# Altium schematic sheet TC377TP.SchDoc
size A3
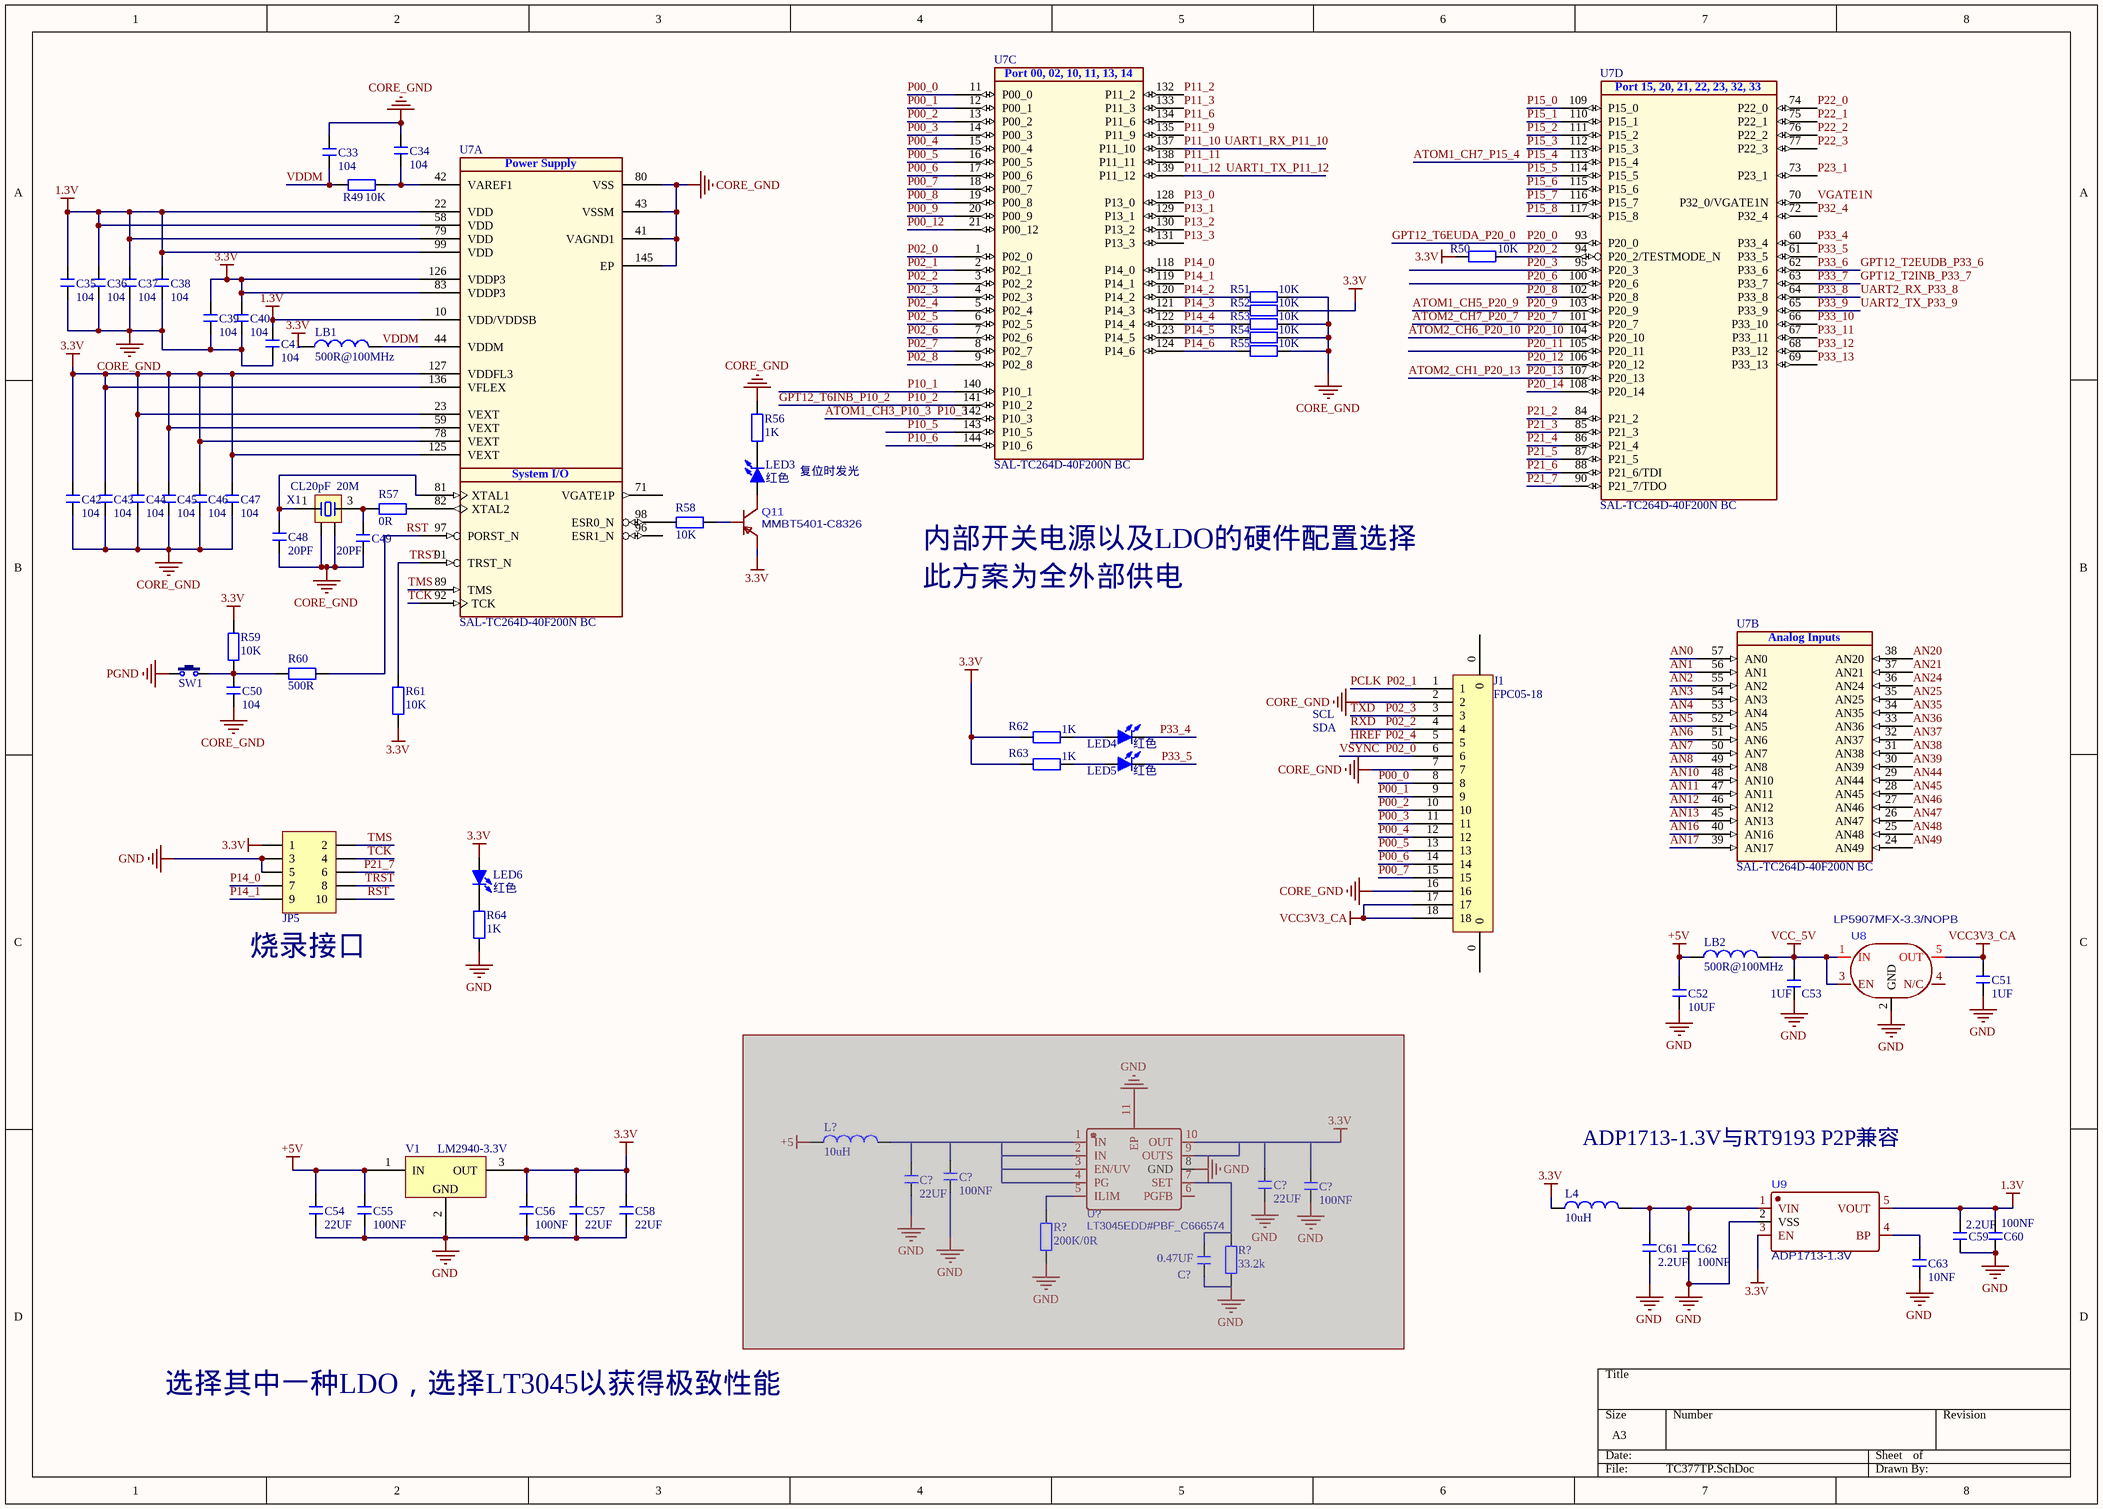
[diagram p0: TC377TP.SchDoc]

## Parts
(Parts that share a designator on the sheet are numbered #1, #2 ... from top to bottom, then left to right.)
C33  104  [C 0603_L]
C34  104  [C 0603_L]
C35  104  [C 0603_L]
C36  104  [C 0603_L]
C37  104  [C 0603_L]
C38  104  [C 0603_L]
C39  104  [C 0603_L]
C40  104  [C 0603_L]
C41  104  [C 0603_L]
C42  104  [C 0603_L]
C43  104  [C 0603_L]
C44  104  [C 0603_L]
C45  104  [C 0603_L]
C46  104  [C 0603_L]
C47  104  [C 0603_L]
C48  20PF  [C 0603_L]
C49  20PF  [C 0603_L]
C50  104  [C 0603_L]
C51  1UF  [C 0805_L]
C52  10UF  [C 0805_L]
C53  1UF  [C 0805_L]
C54  22UF  [C 0805_L]
C55  100NF  [C 0805_L]
C56  100NF  [C 0805_L]
C57  22UF  [C 0805_L]
C58  22UF  [C 0805_L]
C59  2.2UF  [C 0805_L]
C60  100NF  [C 0805_L]
C61  2.2UF  [C 0805_L]
C62  100NF  [C 0805_L]
C63  10NF  [C 0805_L]
C?#1  22UF  [C 0805_L]  (masked out: inside a compile mask, not in the netlist)
C?#2  100NF  [C 0805_L]  (masked out: inside a compile mask, not in the netlist)
C?#3  22UF  [C 0805_L]  (masked out: inside a compile mask, not in the netlist)
C?#4  100NF  [C 0805_L]  (masked out: inside a compile mask, not in the netlist)
C?#5  0.47UF  [C 0805_L]  (masked out: inside a compile mask, not in the netlist)
J1  FPC05-18  [FPC-05-18]
JP5  Header 5X2  [IDC2.54-LI-2x5P]  (value not drawn)
L4  10uH  [L 0805_L]
L?  10uH  [L 0805_L]  (masked out: inside a compile mask, not in the netlist)
LB1  500R@100MHz  [FB 0603_L]
LB2  500R@100MHz  [FB 0805_L]
LED3  红色  [LED 0603Y]
LED4  红色  [LED 0603Y]
LED5  红色  [LED 0603Y]
LED6  红色  [LED 0603Y]
Q11  MMBT5401-C8326  [SOT23-3L]
R49  10K  [R 0603_L]
R50  10K  [R 0603_L]
R51  10K  [R 0603_L]
R52  10K  [R 0603_L]
R53  10K  [R 0603_L]
R54  10K  [R 0603_L]
R55  10K  [R 0603_L]
R56  1K  [R 0603_L]
R57  0R  [R 0603_L]
R58  10K  [R 0603_L]
R59  10K  [R 0603_L]
R60  500R  [R 0603_L]
R61  10K  [R 0603_L]
R62  1K  [R 0603_L]
R63  1K  [R 0603_L]
R64  1K  [R 0603_L]
R?#1  200K/0R  [R 0805_L]  (masked out: inside a compile mask, not in the netlist)
R?#2  33.2k  [R 0805_L]  (masked out: inside a compile mask, not in the netlist)
SW1  3x6x5  [TSW SMD-3*6*2.5]  (value not drawn)
U7  SAL-TC264D-40F200N BC  [QFP50P2200X2200X160-145N-1]  (parts A,B,C,D of 4)
U8  LP5907MFX-3.3/NOPB  [SOT23-5L]
U9  ADP1713-1.3V  [SOT-23-5_L3.0-W1.7-P0.95-LS2.8-BL]
U?  LT3045EDD#PBF_C666574  [LT-3045]  (masked out: inside a compile mask, not in the netlist)
V1  LM2940-3.3V  [SOT223_L]
X1  20M  负载电容: CL20pF  [OSC 3225-4P]

## Nets
1.3V: C35.2 C36.2 C37.2 C38.2 C41.2 C59.1 C60.1 U7.10(VDD/VDDSB) U7.22(VDD) U7.58(VDD) U7.79(VDD) U7.99(VDD) U9.5(VOUT)
3.3V: C39.2 C40.2 C42.2 C43.2 C44.2 C45.2 C46.2 C47.2 C56.2 C57.2 C58.2 JP5.1 L4.1 LB1.1 LED6.1(A) Q11.2(E) R50.1 R52.2 R59.2 R61.1 R62.2 R63.2 U7.23(VEXT) U7.59(VEXT) U7.78(VEXT) U7.83(VDDP3) U7.125(VEXT) U7.126(VDDP3) U7.127(VDDFL3) U7.136(VFLEX) U9.3(EN) V1.3(OUT)
+5V: C52.1 C54.2 C55.2 LB2.1 V1.1(IN)
CORE_GND: C33.2 C34.2 C35.1 C36.1 C37.1 C38.1 C39.1 C40.1 C41.1 C42.1 C43.1 C44.1 C45.1 C46.1 C47.1 C48.1 C49.1 C50.1 J1.2 J1.7 J1.16 R51.2 R53.2 R54.2 R55.2 R56.1 U7.41(VAGND1) U7.43(VSSM) U7.80(VSS) U7.145(EP) X1.2 X1.4
GND: C51.2 C52.2 C53.2 C54.1 C55.1 C56.1 C57.1 C58.1 C59.2 C60.2 C61.2 C62.2 C63.2 JP5.3 JP5.5 R64.1 U8.2(GND) U9.2(VSS) V1.2(GND)
PGND: SW1.1
VCC3V3_CA: C51.1 J1.17 J1.18 U8.5(OUT)
VCC_5V: C53.1 LB2.2 U8.1(IN) U8.3(EN)
AN0: U7.57(AN0)
AN1: U7.56(AN1)
AN2: U7.55(AN2)
AN3: U7.54(AN3)
AN4: U7.53(AN4)
AN5: U7.52(AN5)
AN6: U7.51(AN6)
AN7: U7.50(AN7)
AN8: U7.49(AN8)
AN10: U7.48(AN10)
AN11: U7.47(AN11)
AN12: U7.46(AN12)
AN13: U7.45(AN13)
AN16: U7.40(AN16)
AN17: U7.39(AN17)
AN20: U7.38(AN20)
AN21: U7.37(AN21)
AN24: U7.36(AN24)
AN25: U7.35(AN25)
AN35: U7.34(AN35)
AN36: U7.33(AN36)
AN37: U7.32(AN37)
AN38: U7.31(AN38)
AN39: U7.30(AN39)
AN44: U7.29(AN44)
AN45: U7.28(AN45)
AN46: U7.27(AN46)
AN47: U7.26(AN47)
AN48: U7.25(AN48)
AN49: U7.24(AN49)
ATOM1_CH3_P10_3: U7.142(P10_3)  [also labelled P10_3]
ATOM1_CH5_P20_9: U7.103(P20_9)  [also labelled P20_9]
ATOM1_CH7_P15_4: U7.113(P15_4)  [also labelled P15_4]
ATOM2_CH1_P20_13: U7.107(P20_13)  [also labelled P20_13]
ATOM2_CH6_P20_10: U7.104(P20_10)  [also labelled P20_10]
ATOM2_CH7_P20_7: U7.101(P20_7)  [also labelled P20_7]
GPT12_T2EUDB_P33_6: U7.62(P33_6)  [also labelled P33_6]
GPT12_T2INB_P33_7: U7.63(P33_7)  [also labelled P33_7]
GPT12_T6EUDA_P20_0: U7.93(P20_0)  [also labelled P20_0]
GPT12_T6INB_P10_2: U7.141(P10_2)  [also labelled P10_2]
HREF: J1.5 U7.5(P02_4)  [also labelled P02_4]
P00_0: J1.8 U7.11(P00_0)
P00_1: J1.9 U7.12(P00_1)
P00_2: J1.10 U7.13(P00_2)
P00_3: J1.11 U7.14(P00_3)
P00_4: J1.12 U7.15(P00_4)
P00_5: J1.13 U7.16(P00_5)
P00_6: J1.14 U7.17(P00_6)
P00_7: J1.15 U7.18(P00_7)
P00_8: U7.19(P00_8)
P00_9: U7.20(P00_9)
P00_12: U7.21(P00_12)
P02_0: J1.6 U7.1(P02_0)  [also labelled VSYNC]
P02_1: J1.1 U7.2(P02_1)  [also labelled PCLK]
P02_2: J1.4 U7.3(P02_2)  [also labelled RXD]
P02_3: J1.3 U7.4(P02_3)  [also labelled TXD]
P02_5: U7.6(P02_5)
P02_6: U7.7(P02_6)
P02_7: U7.8(P02_7)
P02_8: U7.9(P02_8)
P10_1: U7.140(P10_1)
P10_5: U7.143(P10_5)
P10_6: U7.144(P10_6)
P11_2: U7.132(P11_2)
P11_3: U7.133(P11_3)
P11_6: U7.134(P11_6)
P11_9: U7.135(P11_9)
P11_10: U7.137(P11_10)  [also labelled UART1_RX_P11_10]
P11_11: U7.138(P11_11)
P11_12: U7.139(P11_12)  [also labelled UART1_TX_P11_12]
P13_0: U7.128(P13_0)
P13_1: U7.129(P13_1)
P13_2: U7.130(P13_2)
P13_3: U7.131(P13_3)
P14_0: JP5.7 U7.118(P14_0)
P14_1: JP5.9 U7.119(P14_1)
P14_2: R51.1 U7.120(P14_2)
P14_3: R52.1 U7.121(P14_3)
P14_4: R53.1 U7.122(P14_4)
P14_5: R54.1 U7.123(P14_5)
P14_6: R55.1 U7.124(P14_6)
P15_0: U7.109(P15_0)
P15_1: U7.110(P15_1)
P15_2: U7.111(P15_2)
P15_3: U7.112(P15_3)
P15_5: U7.114(P15_5)
P15_6: U7.115(P15_6)
P15_7: U7.116(P15_7)
P15_8: U7.117(P15_8)
P20_2: R50.2 U7.94(P20_2/TESTMODE_N)
P20_3: U7.95(P20_3)
P20_6: U7.100(P20_6)
P20_8: U7.102(P20_8)
P20_11: U7.105(P20_11)
P20_12: U7.106(P20_12)
P20_14: U7.108(P20_14)
P21_2: U7.84(P21_2)
P21_3: U7.85(P21_3)
P21_4: U7.86(P21_4)
P21_5: U7.87(P21_5)
P21_6: U7.88(P21_6/TDI)
P21_7: JP5.6 U7.90(P21_7/TDO)
P22_0: U7.74(P22_0)
P22_1: U7.75(P22_1)
P22_2: U7.76(P22_2)
P22_3: U7.77(P22_3)
P23_1: U7.73(P23_1)
P32_4: U7.72(P32_4)
P33_4: LED4.2(K) U7.60(P33_4)
P33_5: LED5.2(K) U7.61(P33_5)
P33_8: U7.64(P33_8)  [also labelled UART2_RX_P33_8]
P33_9: U7.65(P33_9)  [also labelled UART2_TX_P33_9]
P33_10: U7.66(P33_10)
P33_11: U7.67(P33_11)
P33_12: U7.68(P33_12)
P33_13: U7.69(P33_13)
RST: JP5.10 R60.2 U7.97(PORST_N)
TCK: JP5.4 U7.92(TCK)
TMS: JP5.2 U7.89(TMS)
TRST: JP5.8 R61.2 U7.91(TRST_N)
VDDM: C33.1 LB1.2 R49.2 U7.44(VDDM)
VGATE1N: U7.70(P32_0/VGATE1N)
NetC34_1: C34.1 R49.1 U7.42(VAREF1)
NetC48_2: C48.2 U7.81(XTAL1) X1.1
NetC49_2: C49.2 R57.1 X1.3
NetC50_2: C50.2 R59.1 R60.1 SW1.2
NetC61_1: C61.1 C62.1 L4.2 U9.1(VIN)
NetC63_1: C63.1 U9.4(BP)
NetLED3_1: LED3.1(A) Q11.3(C)
NetLED3_2: LED3.2(K) R56.2
NetLED4_1: LED4.1(A) R62.1
NetLED5_1: LED5.1(A) R63.1
NetLED6_2: LED6.2(K) R64.2
NetQ11_1: Q11.1(B) R58.1
NetR57_2: R57.2 U7.82(XTAL2)
NetR58_2: R58.2 U7.98(ESR0_N)

Not connected (* = marked no-connect by the designer): J1 0; U7 71(VGATE1P) 96(ESR1_N); U8 4(N/C)

## Notes on the sheet
- 复位时发光
- 内部开关电源以及LDO的硬件配置选择
- 此方案为全外部供电
- SCL
- SDA
- (near JP5) 烧录接口
- ADP1713-1.3V与RT9193 P2P兼容
- 选择其中一种LDO，选择LT3045以获得极致性能
- (in symbol SAL-TC264D-40F200N BC, part A) Power Supply; System I/O
- (in symbol SAL-TC264D-40F200N BC, part B) Analog Inputs
- (in symbol SAL-TC264D-40F200N BC, part C) Port 00, 02, 10, 11, 13, 14
- (in symbol SAL-TC264D-40F200N BC, part D) Port 15, 20, 21, 22, 23, 32, 33

## Library data of the parts
C33-C63 C?#1-C?#5 = C: 无极性贴片电容; 版权归属: 源创客; 材质: X7R; BOM名称: 无极性贴片电容; 学习资源: www.ooocke.com
JP5 = Header 5X2: 5*2P接插件; 版权归属: 源创客; BOM名称: 5*2P接插件; 学习资源: www.ooocke.com
L4 L? = L: 小功率贴片电感; 版权归属: 源创客; BOM名称: 小功率贴片电感; 学习资源: www.ooocke.com
LB1 LB2 = LB: 磁珠; 版权归属: 源创客; BOM名称: 磁珠; 学习资源: www.ooocke.com
LED3-LED6 = LED-SMD: 贴片LED; 版权归属: 源创客; BOM名称: 贴片LED; 学习资源: www.ooocke.com
R49-R64 R?#1 R?#2 = R: 贴片电阻; 版权归属: 源创客; BOM名称: 贴片电阻; 学习资源: www.ooocke.com
SW1 = TSW 3x6: 3x6轻触开关; 版权归属: 源创客; BOM名称: 3x6轻触开关; 学习资源: www.ooocke.com
U7 = SAL-TC264D-40F200N BC: 32-Bit Single-Chip Microcontroller BC-Step; Manufacturer: Infineon Technologies; PackageReference: PG-LQFP-144-22; ManufacturerPartNumber: SAL-TC264D-40F200N BC
U8 = LP5907MFX-1.8/NOPB
U9 = RT9193-18PB
U? = LT3045EDD#PBF_C666574: BOM_Manufacturer: Analog Devices; Contributor: LCSC; BOM_Supplier: LCSC; BOM_Supplier Part: C666574; BOM_Manufacturer Part: LT3045EDD#PBF; BOM_JLCPCB Part Class: Extended Part; spicePre: U; spiceSymbolName: LT3045EDD#PBF_C666574
V1 = LM2940: 5V稳压芯片; 版权归属: 源创客; BOM名称: 5V稳压芯片; 学习资源: www.ooocke.com
X1 = XTAL-4P: 4脚无源晶振; 版权归属: 源创客; BOM名称: 4脚无源晶振; 学习资源: www.ooocke.com